# Altium schematic sheet Deathsound_preamp.SchDoc
size A4
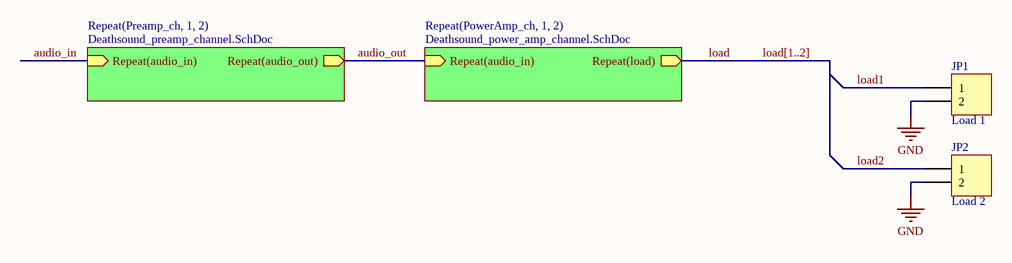
[diagram p0: Deathsound_preamp.SchDoc]

## Parts
JP1  Load 1  [HDR1X2]
JP2  Load 2  [HDR1X2]

## Sub-sheets
Repeat(PowerAmp_ch, 1, 2) = Deathsound_power_amp_channel.SchDoc: Repeat(load) (out), Repeat(audio_in) (in)
Repeat(Preamp_ch, 1, 2) = Deathsound_preamp_channel.SchDoc: Repeat(audio_in) (in), Repeat(audio_out) (out)

## Nets
GND: JP1.2 JP2.2
audio_in: sheet Repeat(Preamp_ch, 1, 2)/Repeat(audio_in)
audio_out: sheet Repeat(Preamp_ch, 1, 2)/Repeat(audio_out), sheet Repeat(PowerAmp_ch, 1, 2)/Repeat(audio_in)
load: sheet Repeat(PowerAmp_ch, 1, 2)/Repeat(load)
load1: JP1.1
load2: JP2.1

## Buses and harness runs
bus load[1..2]

## Library data of the parts
JP1 JP2 = Header 2: Header, 2-Pin